# EAGLE design front_panel (EAGLE 9.4.2)
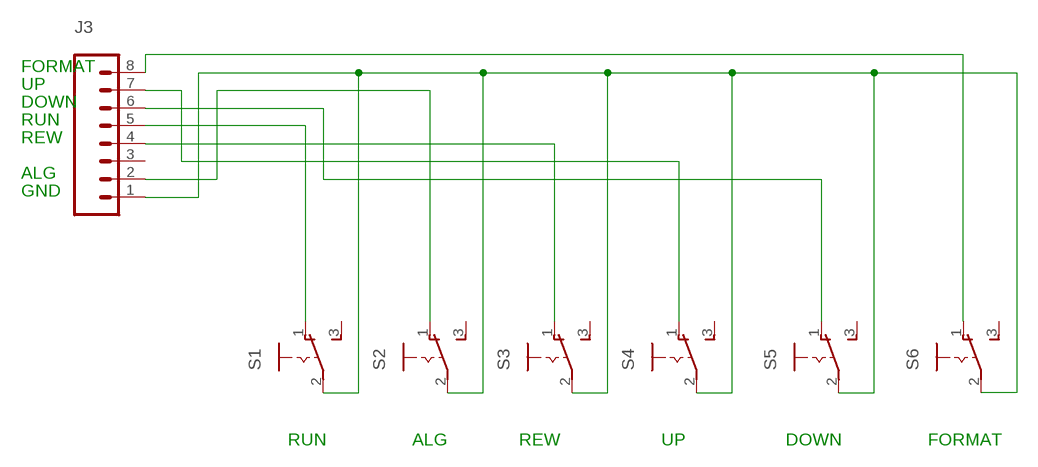
[diagram p0: schematic, sheet 1]

## Parts
J3  CONN_08"  [1X08]
S1  M251  [M251]
S2  M251  [M251]
S3  M251  [M251]
S4  M251  [M251]
S5  M251  [M251]
S6  M251  [M251]

## Nets
N$1: J3.1 S1.2(P) S2.2(P) S3.2(P) S4.2(P) S5.2(P) S6.2(P)
N$3: J3.6 S5.1(O)
N$4: J3.4 S3.1(O)
N$5: J3.7 S4.1(O)
N$6: J3.2 S2.1(O)
N$7: J3.5 S1.1(O)
N$8: J3.8 S6.1(O)
Unconnected: J3.3 S1.3(S) S2.3(S) S3.3(S) S4.3(S) S5.3(S) S6.3(S)

## Notes on the sheet
- FORMAT
- UP
- DOWN
- RUN
- REW
- ALG
- GND
- RUN | ALG | REW | UP | DOWN | FORMAT

## Library data of the parts
J3 = SparkFun-Connectors:CONN_08: Multi connection point. Often used as Generic Header-pin footprint for 0.1 inch spaced/style header connections On any of the 0.1 inch spaced packages, you can populate with these: Break Away Headers - Straight <https://www.sparkfun.com/products/116> (PRT-00116) Break Away Male Headers - Right Angle <https://www.sparkfun.com/products/553> (PRT-00553) Female Headers <https://www.sparkfun.com/products/115> (PRT-00115) Break Away Headers - Machine Pin <https://www.sparkfun.com/products/117> (PRT-00117) Break Away Female Headers - Swiss Machine Pin <https://www.sparkfun.com/products/743> (PRT-00743) Arduino Stackable Header - 8 Pin <https://www.sparkfun.com/products/9279> (PRT-09279) For SCREWTERMINALS and SPRING TERMINALS visit here: Screw Terimnals on SparkFun.com <https://www.sparkfun.com/search/results?term=Screw+Terminals> (5mm/3.5mm/2.54mm spacing) This device is also useful as a general connection point to wire up your design to another part of your project. Our various solder wires solder well into these plated through hole pads. Hook-Up Wire - Assortment (Stranded, 22 AWG) <https://www.sparkfun.com/products/11375> (PRT-11375) Hook-Up Wire - Assortment (Solid Core, 22 AWG) <https://www.sparkfun.com/products/11367> (PRT-11367) View the entire wire category on our website here <https://www.sparkfun.com/categories/141> Special notes: Molex polarized connector foot print use with SKU : PRT-08231 with associated crimp pins and housings. 1MM SMD Version SKU: PRT-10208 NOTES ON THE VARIANTS LOCK and LOCK_LONGPADS... This footprint was designed to help hold the alignment of a through-hole component (i.e. 6-pin header) while soldering it into place. You may notice that each hole has been shifted either up or down by 0.005 of an inch from it's more standard position (which is a perfectly straight line). This slight alteration caused the pins (the squares in the middle) to touch the edges of the holes. Because they are alternating, it causes a "brace" to hold the component in place. 0.005 has proven to be the perfect amount of "off-center" position when using our standard breakaway headers. Although looks a little odd when you look at the bare footprint, once you have a header in there, the alteration is very hard to notice. Also,if you push a header all the way into place, it is covered up entirely on the bottom side.; PROD_ID: CONN-08438
S1-S6 = switch:M251: SLIDING SWITCH Mors, distributor Buerklin, 11G702

## Board
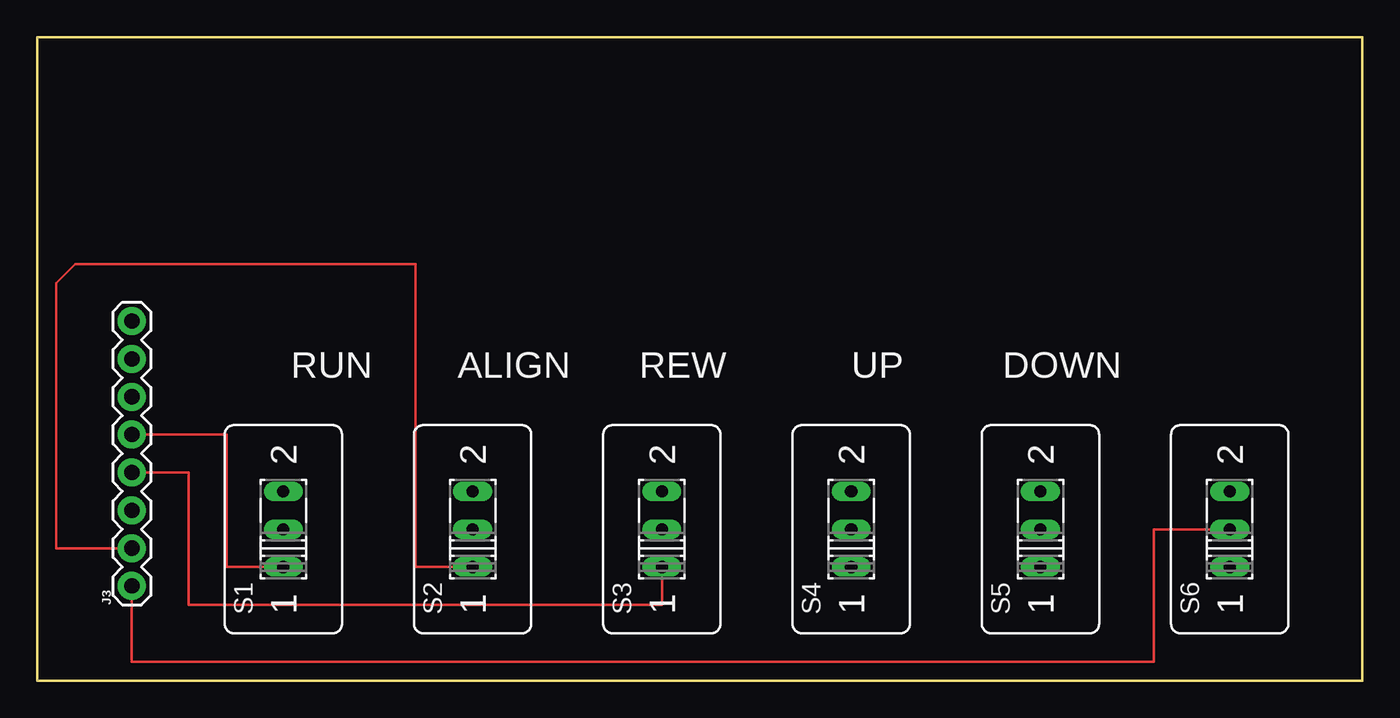
[diagram p1: board, top side]
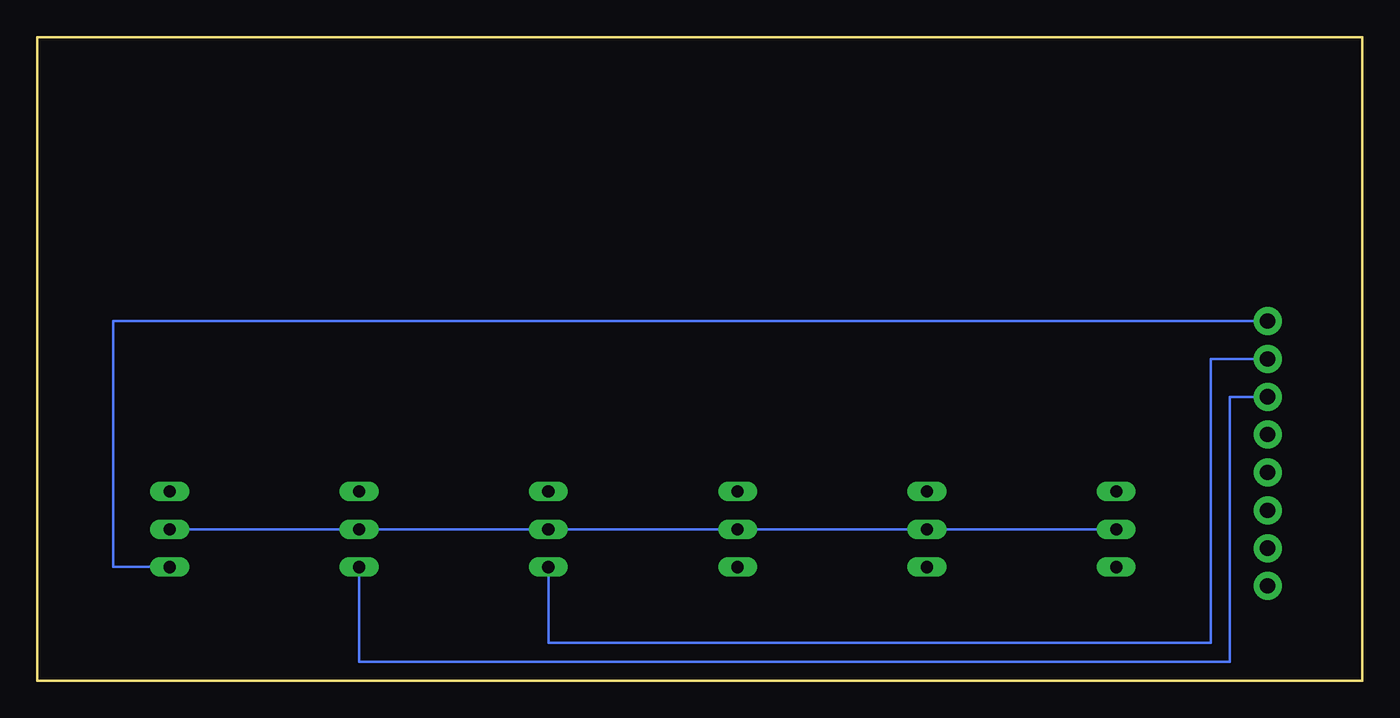
[diagram p2: board, bottom side, seen from below]

Size 88.9 x 43.18 mm. Coordinates in mm from the lower left corner, seen from the top.
Outline: 0,0 0,43.18 88.9,43.18 88.9,0 0,0
Copper layers (1*16): Top 0.035mm / dielectric 1.5mm / Bottom 0.035mm
Design rules "default": minimum track width 6mil, minimum drill 0.35mm, track to track 6mil, track to pad 6mil, pad to pad 6mil, via to via 6mil, smd to smd 6mil, copper to edge 40mil, drill to drill 6mil, minimum pad ring 10mil, minimum via ring 8mil, stop-mask expansion 4mil, vias tented up to drill 0mil, thermal gap 10mil

### Footprints (pad centres in the part's own frame; a part is rotated, then mirrored left to right if it is on the bottom)
1X08 = drill 1.016 pad 1.88: 1 0,0; 2 2.54,0; 3 5.08,0; 4 7.62,0; 5 10.16,0; 6 12.7,0; 7 15.24,0; 8 17.78,0
M251 = drill 0.813 long: 1 -2.54,0; 2 0,0; 3 2.54,0

### Placement (x,y rotation side)
J3  6.35,6.35 90 top
S1  16.51,10.16 90 top
S2  29.21,10.16 90 top
S3  41.91,10.16 90 top
S4  54.61,10.16 90 top
S5  67.31,10.16 90 top
S6  80.01,10.16 90 top

### Tracks (layer width: path | path; a pad name or v marks a point on that pad's centre or on a via)
N$1
  Top 0.152: J3.1 6.35,1.27 74.93,1.27 74.93,10.16 S6.2
  Bottom 0.152: S1.2 S2.2 S3.2 S4.2 S5.2 S6.2
N$3
  Bottom 0.152: S5.1 67.31,1.27 8.89,1.27 8.89,19.05 J3.6
N$4
  Top 0.152: S3.1 41.91,5.08 10.16,5.08 10.16,13.97 J3.4
N$5
  Bottom 0.152: S4.1 54.61,2.54 10.16,2.54 10.16,21.59 J3.7
N$6
  Top 0.152: S2.1 25.4,7.62 25.4,27.94 2.54,27.94 1.27,26.67 1.27,8.89 J3.2
N$7
  Top 0.152: S1.1 12.7,7.62 12.7,16.51 J3.5
N$8
  Bottom 0.152: S6.1 83.82,7.62 83.82,24.13 J3.8

### Text on the board
tNames: RUN | ALIGN | REW | UP | DOWN